# Altium schematic sheet TXS0102YZPR.SchDoc
size A4
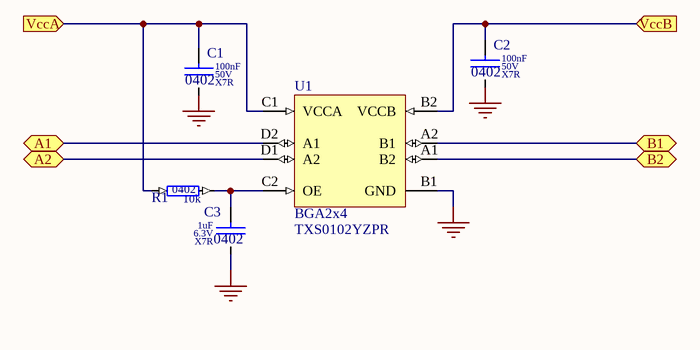
[diagram p0: TXS0102YZPR.SchDoc]

## Parts
C1  value 100nF  Dielectric: X7R  Voltage: 50V  SCH_Footprint: 0402  [C_0402_1005]  (hidden comment: Ceramic X7R)
C2  value 100nF  Dielectric: X7R  Voltage: 50V  SCH_Footprint: 0402  [C_0402_1005]  (hidden comment: Ceramic X7R)
C3  value 1uF  Dielectric: X7R  Voltage: 6.3V  SCH_Footprint: 0402  [C_0402_1005]  (hidden comment: Ceramic X7R)
R1  value 10k  SCH_Footprint: 0402  [R_0402_1005]  (hidden comment: Resistor)
U1  value TXS0102YZPR  SCH_Footprint: BGA2x4  [BGA_2x4x0.5mm]  (hidden comment: Level shifter)

## Ports
A1 (bidir), A2 (bidir), B1 (bidir), B2 (bidir), VccA (in), VccB (in)

## Nets
GND: C1.2 C2.2 C3.2 U1.B1(GND)
A1: U1.D2(A1) ; port A1
A2: U1.D1(A2) ; port A2
B1: U1.A2(B1) ; port B1
B2: U1.A1(B2) ; port B2
VccA: C1.1 R1.1 U1.C1(VCCA) ; port VccA
VccB: C2.1 U1.B2(VCCB) ; port VccB
NetC3_1: C3.1 R1.2 U1.C2(OE)

## Notes on the sheet
- Title:
- Sheet:
- of
- Author:
- Model:
- Document Number:
- Checked by:
- Iss-Rev:
- Approved by:
- Date:
- File name:

## Library data of the parts
C1 C2 = C_100nF_50V_X7R_0402_10: Capacitor; Manufacturer: Murata; Manufacturer Part Number: GRM155R71H104KE14D; Tolerance (%): 10; Part Number: C_100nF_50V_X7R_0402_10; HelpURL: http://docs-europe.electrocomponents.com/webdocs/145f/0900766b8145f9d2.pdf; Supplier 1: TME; Supplier Part Number 1: GRM155R71H104KE14D; Supplier 2: RS Components; Supplier Part Number 2: 8847087; Supplier 3: Farnell; Supplier Part Number 3: 2611912; Supplier 4: Mouser; Supplier Part Number 4: 81-GRM155R71H104KE4D; Supplier 5: Digi-Key; Supplier Part Number 5: 490-10700-1-ND
C3 = C_1uF_6.3V_X7R_0402_10: Capacitor; Manufacturer: Murata; Manufacturer Part Number: GRM155R70J105KA12D; Tolerance (%): 10; Part Number: C_1uF_6.3V_X7R_0402_10; HelpURL: https://www.mouser.com/ds/2/281/c02e-2905.pdf; Supplier 1: TME; Supplier 2: RS Components; Supplier 3: Farnell; Supplier 4: Mouser; Supplier Part Number 4: 81-GRM155R70J105KA2D; Supplier 5: Digi-Key
R1 = R_10k_0402_1: Manufacturer: Yageo; Manufacturer Part Number: RC0402FR-0710KL; Voltage: 50V; Power: 63mW; Tolerance: 1%; Part Number: R_10k_0402_1; HelpURL: http://www.tme.eu/pl/Document/1a2bc76e2be68b3b1670068306778ce6/rc0402yageo.pdf; Supplier 1: TME; Supplier Part Number 1: RC0402FR-0710K; Supplier 2: RS Components; Supplier 3: Farnell; Supplier 4: Mouser; Supplier 5: Digi-Key
U1 = U_TXS0102YZPR: Manufacturer: Texas Instruments; Part Number: U_TXS0102YZPR; HelpURL: http://www.ti.com/lit/ds/symlink/txs0102.pdf; Manufacturer Part Number: TXS0102YZPR; Supplier 1: TME; Supplier 2: RS Components; Supplier Part Number 2: 8175650P; Supplier 3: Farnell; Supplier Part Number 3: 2335616; Supplier 4: Mouser; Supplier Part Number 4: 595-TXS0102YZPR; Supplier 5: Digi-Key; Supplier Part Number 5: 296-21932-1-ND